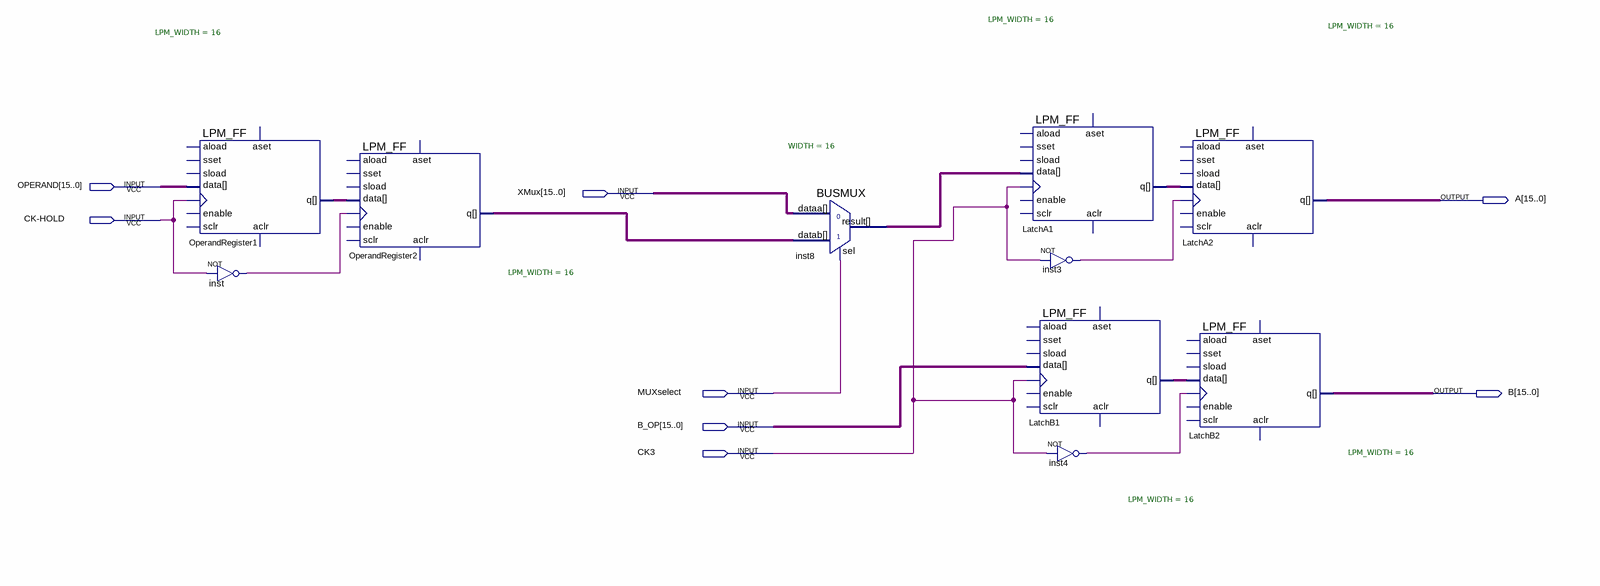
[diagram p0: schematic sheet]
// Quartus schematic operandsUnit.bdf as structural Verilog: 10 symbols, 8 pins
module operandsUnit (
  input  [15:0] OPERAND,
  input  [15:0] XMux,
  input  \CK-HOLD ,
  input  MUXselect,
  input  [15:0] B_OP,
  input  CK3,
  output [15:0] A,
  output [15:0] B
);

  wire inst3_out, inst4_out, inst_out;
  wire [15:0] inst8_result, LatchA1_q, LatchB1_q, OperandRegister1_q, OperandRegister2_q;

  LPM_FF #(.LPM_WIDTH(16)) OperandRegister1 (
    .clock(\CK-HOLD ), .data(OPERAND), .q(OperandRegister1_q));  // open: enable, aload, sset, sload, aset, sclr, aclr
  not inst (inst_out, \CK-HOLD );
  LPM_FF #(.LPM_WIDTH(16)) OperandRegister2 (
    .clock(inst_out), .data(OperandRegister1_q), .q(OperandRegister2_q));  // open: enable, aload, sset, sload, aset, sclr, aclr
  BUSMUX #(.WIDTH(16)) inst8 (.datab(OperandRegister2_q), .sel(MUXselect), .dataa(XMux), .result(inst8_result));
  LPM_FF #(.LPM_WIDTH(16)) LatchA1 (
    .clock(CK3), .data(inst8_result), .q(LatchA1_q));  // open: enable, aload, sset, sload, aset, sclr, aclr
  not inst3 (inst3_out, CK3);
  LPM_FF #(.LPM_WIDTH(16)) LatchB1 (
    .clock(CK3), .data(B_OP), .q(LatchB1_q));  // open: enable, aload, sset, sload, aset, sclr, aclr
  not inst4 (inst4_out, CK3);
  LPM_FF #(.LPM_WIDTH(16)) LatchA2 (
    .clock(inst3_out), .data(LatchA1_q), .q(A));  // open: enable, aload, sset, sload, aset, sclr, aclr
  LPM_FF #(.LPM_WIDTH(16)) LatchB2 (
    .clock(inst4_out), .data(LatchB1_q), .q(B));  // open: enable, aload, sset, sload, aset, sclr, aclr
endmodule
